# EAGLE design Foozle2650 (EAGLE 9.6.2)

## Sheet 1 of 2: Main
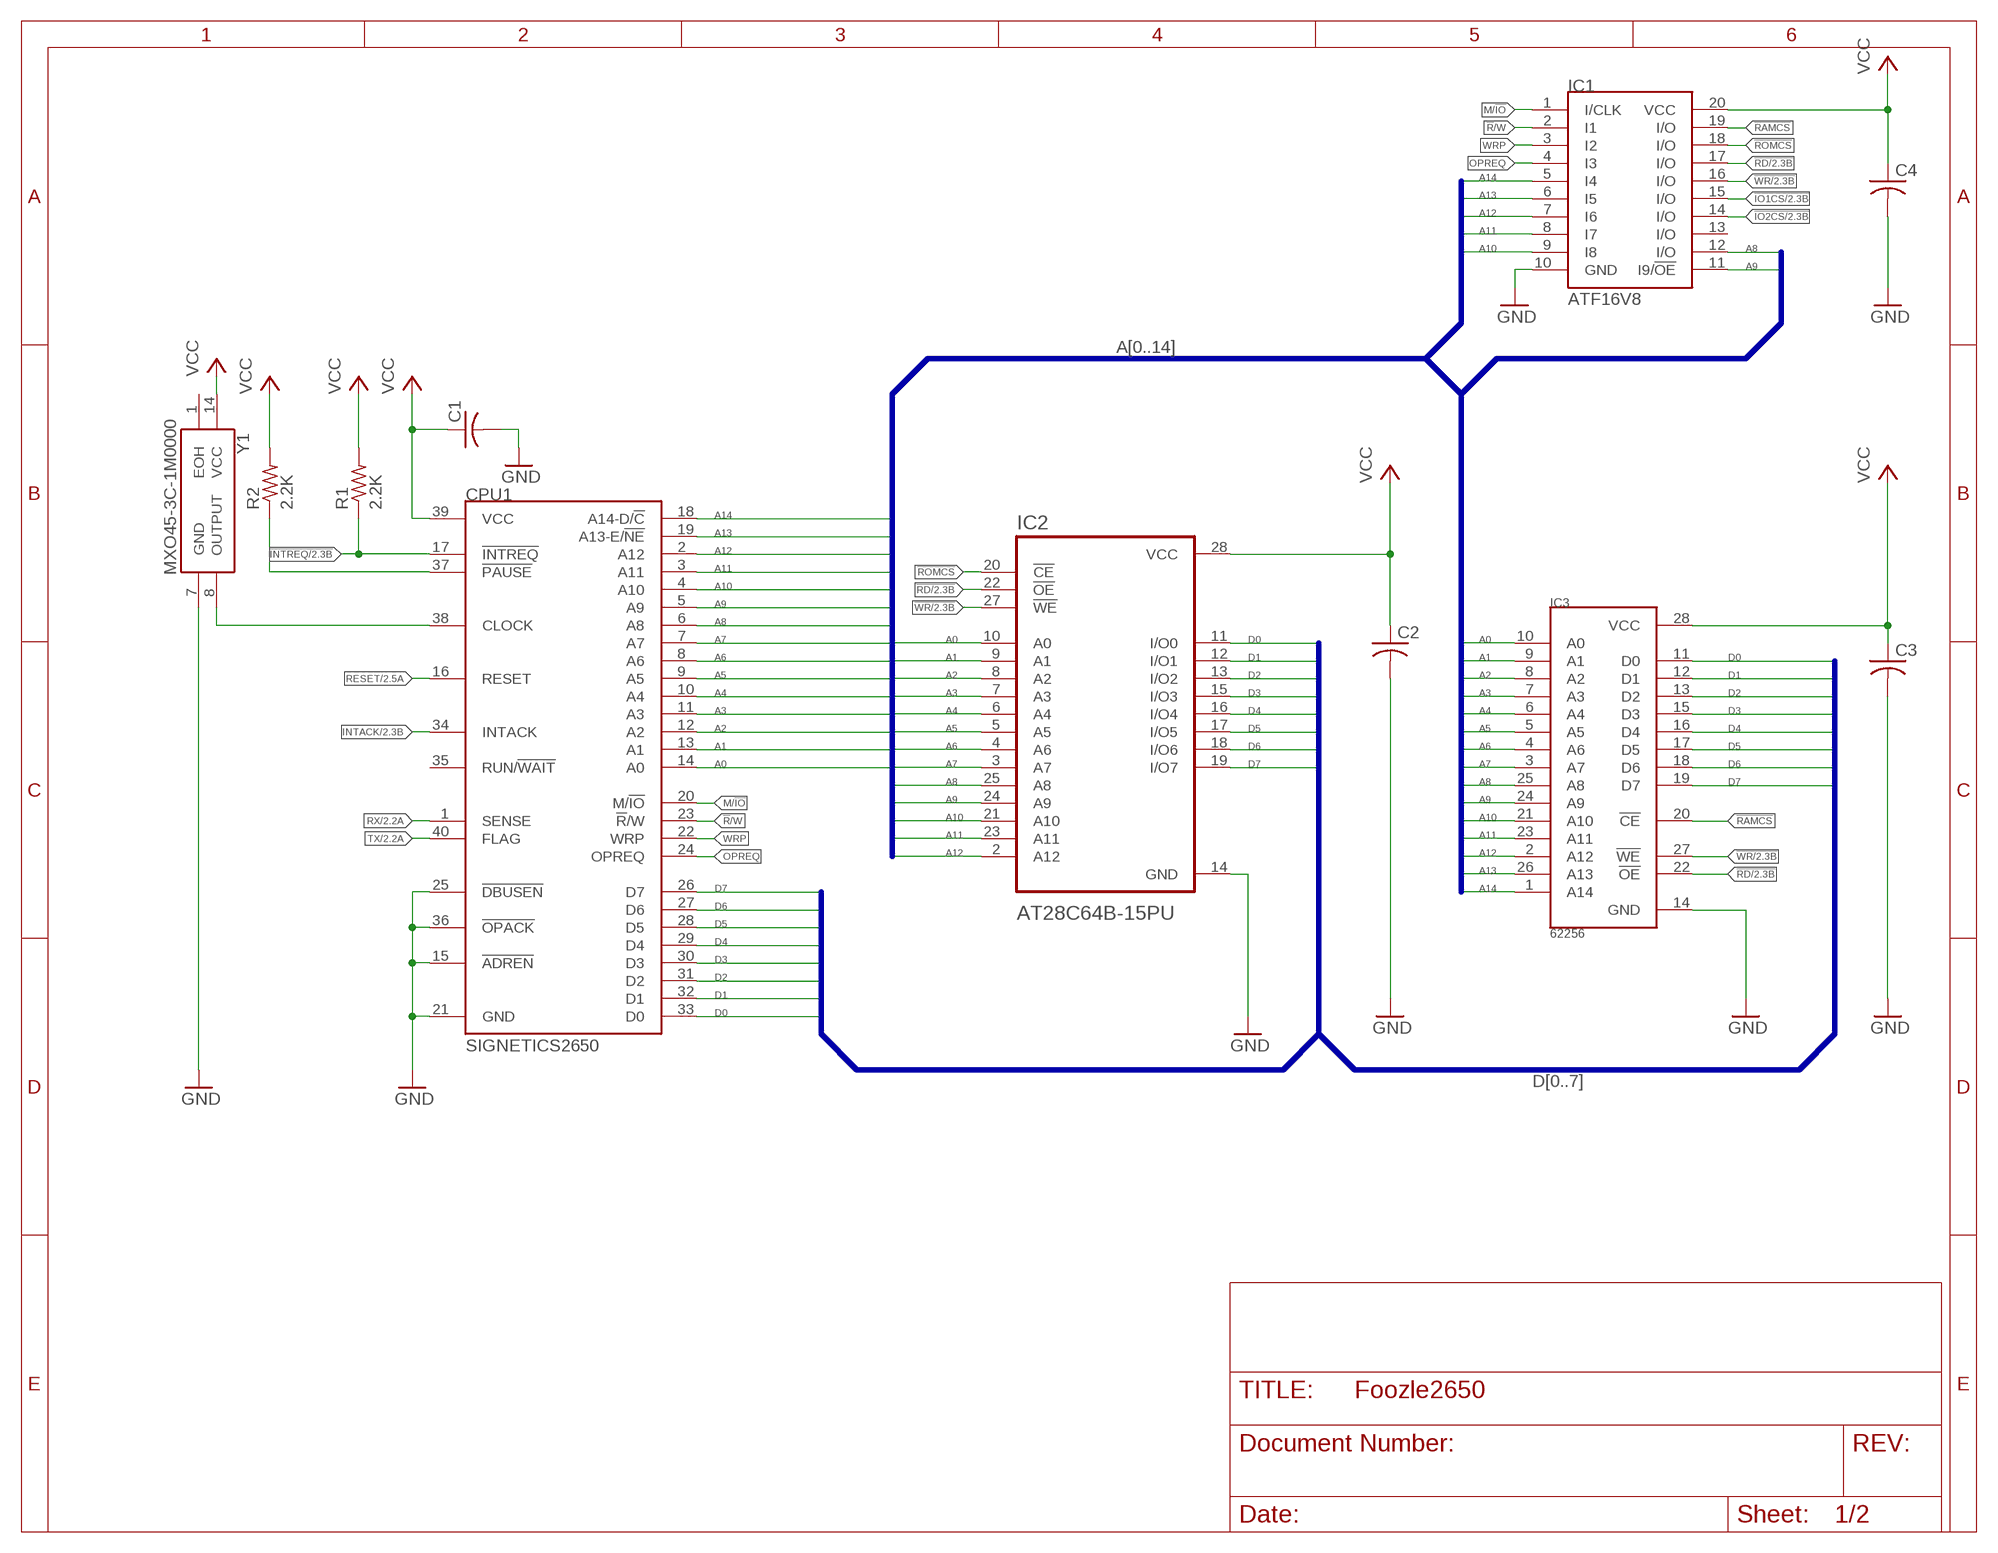
[diagram p0: schematic, sheet 1]

### Parts
C1  C-US025-024X044  [C025-024X044]
C2  C-US025-024X044  [C025-024X044]
C3  C-US025-024X044  [C025-024X044]
C4  C-US025-024X044  [C025-024X044]
CPU1  SIGNETICS2650  [DIL40]
IC1  ATF16V8  [DIL20]
IC2  AT28C64B-15PU  [DIP1555W45P254L3733H482Q28]
IC3  62256  [DIP-28/600MIL]
R1  2.2K  R-US_0204/7  [0204/7]
R2  2.2K  R-US_0204/7  [0204/7]
Y1  MXO45-3C-1M0000  [MXO453C1M0000]

### Nets
!INTREQ: CPU1.17(!INTREQ) R1.1 ; also sheet 2
!IO1CS: IC1.15(I/O) ; also sheet 2
!IO2CS: IC1.14(I/O) ; also sheet 2
!R!/W: CPU1.23(!R!/W) IC1.2(I1)
!RAMCS: IC1.19(I/O) IC3.20(!CE)
!RD: IC1.17(I/O) IC2.22(!OE) IC3.22(!OE) ; also sheet 2
!ROMCS: IC1.18(I/O) IC2.20(!CE)
!WR: IC1.16(I/O) IC2.27(!WE) IC3.27(!WE) ; also sheet 2
A0: CPU1.14(A0) IC2.10(A0) IC3.10(A0) ; also sheet 2
A1: CPU1.13(A1) IC2.9(A1) IC3.9(A1) ; also sheet 2
A2: CPU1.12(A2) IC2.8(A2) IC3.8(A2) ; also sheet 2
A3: CPU1.11(A3) IC2.7(A3) IC3.7(A3) ; also sheet 2
A4: CPU1.10(A4) IC2.6(A4) IC3.6(A4) ; also sheet 2
A5: CPU1.9(A5) IC2.5(A5) IC3.5(A5) ; also sheet 2
A6: CPU1.8(A6) IC2.4(A6) IC3.4(A6) ; also sheet 2
A7: CPU1.7(A7) IC2.3(A7) IC3.3(A7)
A8: CPU1.6(A8) IC1.12(I/O) IC2.25(A8) IC3.25(A8)
A9: CPU1.5(A9) IC1.11(I9/!OE) IC2.24(A9) IC3.24(A9)
A10: CPU1.4(A10) IC1.9(I8) IC2.21(A10) IC3.21(A10)
A11: CPU1.3(A11) IC1.8(I7) IC2.23(A11) IC3.23(A11)
A12: CPU1.2(A12) IC1.7(I6) IC2.2(A12) IC3.2(A12)
A13: CPU1.19(A13-E/!NE) IC1.6(I5) IC3.26(A13)
A14: CPU1.18(A14-D/!C) IC1.5(I4) IC3.1(A14)
CLOCK: CPU1.38(CLOCK) Y1.8(OUTPUT) ; also sheet 2
D0: CPU1.33(D0) IC2.11(I/O0) IC3.11(D0) ; also sheet 2
D1: CPU1.32(D1) IC2.12(I/O1) IC3.12(D1) ; also sheet 2
D2: CPU1.31(D2) IC2.13(I/O2) IC3.13(D2) ; also sheet 2
D3: CPU1.30(D3) IC2.15(I/O3) IC3.15(D3) ; also sheet 2
D4: CPU1.29(D4) IC2.16(I/O4) IC3.16(D4) ; also sheet 2
D5: CPU1.28(D5) IC2.17(I/O5) IC3.17(D5) ; also sheet 2
D6: CPU1.27(D6) IC2.18(I/O6) IC3.18(D6) ; also sheet 2
D7: CPU1.26(D7) IC2.19(I/O7) IC3.19(D7) ; also sheet 2
GND: C1.2 C2.2 C3.2 C4.2 CPU1.15(!ADREN) CPU1.21(GND) CPU1.25(!DBUSEN) CPU1.36(!OPACK) IC1.10(GND) IC2.14(GND) IC3.14(GND) Y1.7(GND) ; also sheet 2
INTACK: CPU1.34(INTACK) ; also sheet 2
M/!IO: CPU1.20(M/!IO) IC1.1(I/CLK)
N$3: CPU1.37(!PAUSE) R2.1
OPREQ: CPU1.24(OPREQ) IC1.4(I3)
RESET: CPU1.16(RESET) ; also sheet 2
RX: CPU1.1(SENSE) ; also sheet 2
TX: CPU1.40(FLAG) ; also sheet 2
VCC: C1.1 C2.1 C3.1 C4.1 CPU1.39(VCC) IC1.20(VCC) IC2.28(VCC) IC3.28(VCC) R1.2 R2.2 Y1.14(VCC) ; also sheet 2
WRP: CPU1.22(WRP) IC1.3(I2)
Unconnected: CPU1.35(RUN/!WAIT) IC1.13(I/O) Y1.1(EOH)

### Buses
A[0..14]
D[0..7]

## Sheet 2 of 2: IO
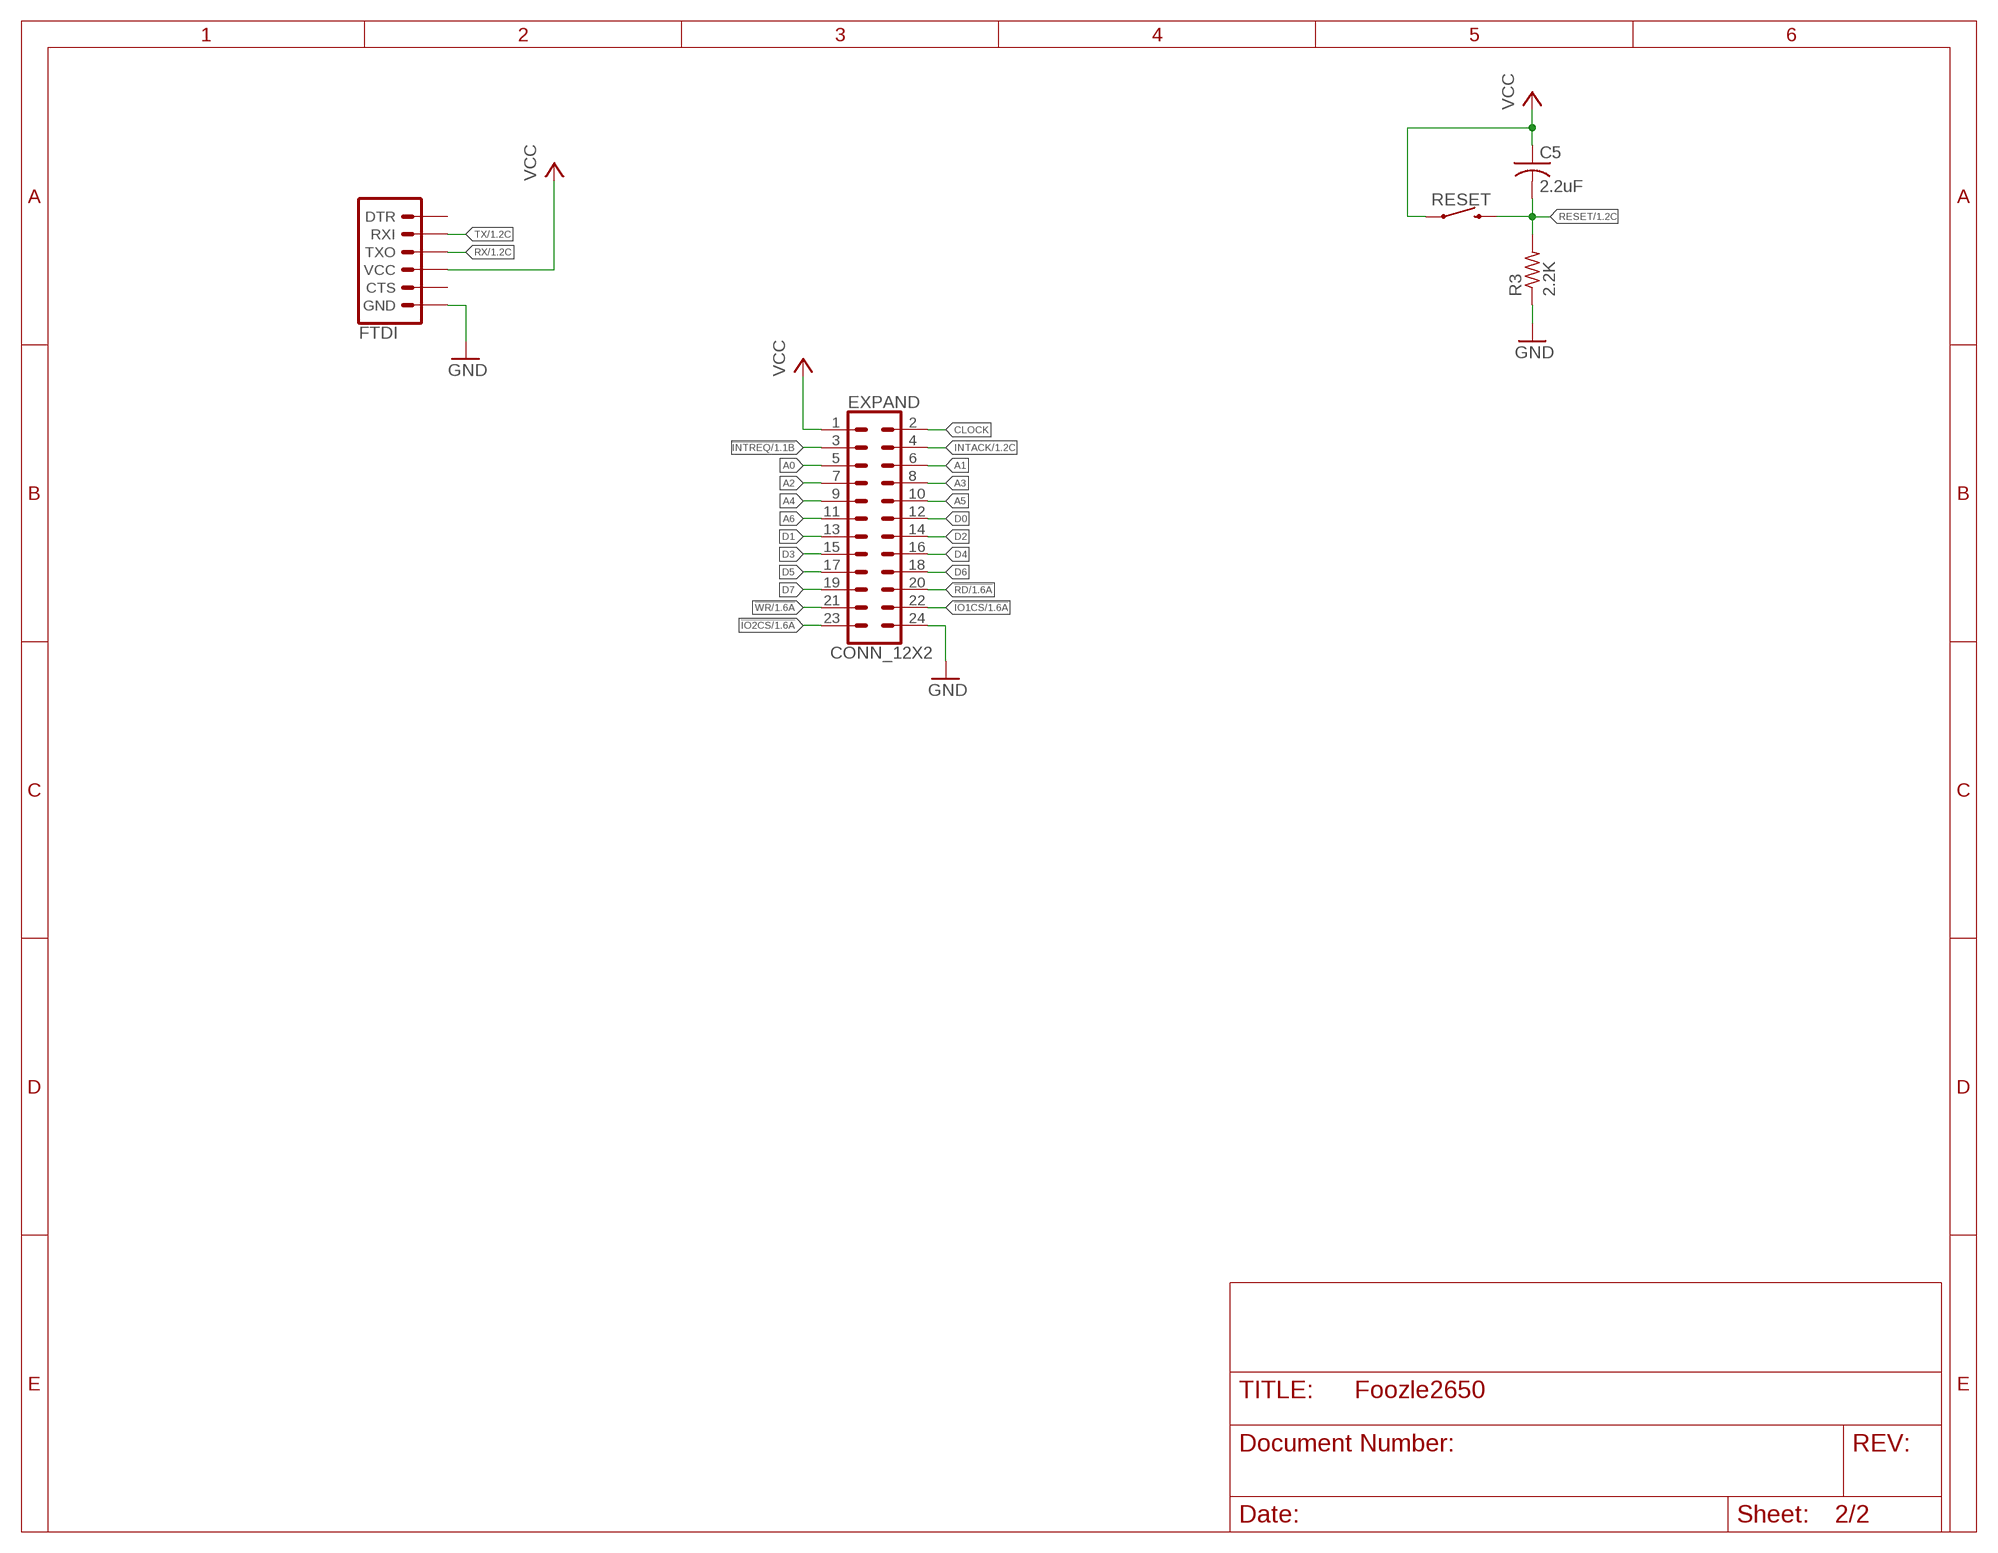
[diagram p1: schematic, sheet 2]

### Parts
C5  2.2uF  C-US025-024X044  [C025-024X044]
EXPAND  CONN_12X2  [2X12]
FTDI  6_PIN_SERIAL_TARGETLONGPADS  [1X06_LONGPADS]
R3  2.2K  R-US_0204/7  [0204/7]
RESET  MOMENTARY-SWITCH-SPST-PTH-6.0MM  [TACTILE_SWITCH_PTH_6.0MM]

### Nets
!INTREQ: EXPAND.3 ; also sheet 1
!IO1CS: EXPAND.22 ; also sheet 1
!IO2CS: EXPAND.23 ; also sheet 1
!RD: EXPAND.20 ; also sheet 1
!WR: EXPAND.21 ; also sheet 1
A0: EXPAND.5 ; also sheet 1
A1: EXPAND.6 ; also sheet 1
A2: EXPAND.7 ; also sheet 1
A3: EXPAND.8 ; also sheet 1
A4: EXPAND.9 ; also sheet 1
A5: EXPAND.10 ; also sheet 1
A6: EXPAND.11 ; also sheet 1
CLOCK: EXPAND.2 ; also sheet 1
D0: EXPAND.12 ; also sheet 1
D1: EXPAND.13 ; also sheet 1
D2: EXPAND.14 ; also sheet 1
D3: EXPAND.15 ; also sheet 1
D4: EXPAND.16 ; also sheet 1
D5: EXPAND.17 ; also sheet 1
D6: EXPAND.18 ; also sheet 1
D7: EXPAND.19 ; also sheet 1
GND: EXPAND.24 FTDI.6(GND) R3.1 ; also sheet 1
INTACK: EXPAND.4 ; also sheet 1
RESET: C5.2 R3.2 RESET.3 ; also sheet 1
RX: FTDI.3(TXO) ; also sheet 1
TX: FTDI.2(RXI) ; also sheet 1
VCC: C5.1 EXPAND.1 FTDI.4(VCC) RESET.1 ; also sheet 1
Unconnected: FTDI.1(DTR) FTDI.5(CTS)

## Library data of the parts
C1-C5 = adafruit:C-US: CAPACITOR, American symbol
CPU1 = StuffLabs:SIGNETICS2650
EXPAND = SparkFun-Connectors:CONN_12X2: Multi connection point. Often used as Generic Header-pin footprint for 0.1 inch spaced/style header connections On any of the 0.1 inch spaced packages, you can populate with these: Break Away Headers - Straight <https://www.sparkfun.com/products/116> (PRT-00116) Break Away Male Headers - Right Angle <https://www.sparkfun.com/products/553> (PRT-00553) Female Headers <https://www.sparkfun.com/products/115> (PRT-00115) Break Away Headers - Machine Pin <https://www.sparkfun.com/products/117> (PRT-00117) Break Away Female Headers - Swiss Machine Pin <https://www.sparkfun.com/products/743> (PRT-00743)
FTDI = SparkFun-Connectors:6_PIN_SERIAL_TARGET: 6-pin header connection for use with the "FTDI BASIC" pinout - TARGET SIDE. Also known as "Arduino Serial Program Header". It is used to mate with our FTDI Basic serial programmers using the Arduino IDE. Note, this device has "TARGET" in the name. It is intended to be used on a design that contains a target micro-controller that you wish to program. The "sister" device, named "CABLE" is inteneded to be used on a design that usually lives on the end of your USB cable and prvides the converter chip (FTDI232 or FTDI231x) to commnicate serial RX/TX. You can populate with some of these: Break Away Headers - Straight <https://www.sparkfun.com/products/116> (PRT-00116) For reference (or to suit your programming needs) check out these designs: SparkFun FTDI Basic Breakout - 5V <https://www.sparkfun.com/products/9716> (DEV-09716) SparkFun FTDI Basic Breakout - 3.3V <https://www.sparkfun.com/products/9873> (DEV-09873) SparkFun FTDI SmartBasic <https://www.sparkfun.com/products/12935> (DEV-12935) SparkFun Beefy 3 - FTDI Basic Breakout <https://www.sparkfun.com/products/13746> (DEV-13746)
IC1 = StuffLabs:ATF16V8: ATMEL ATF16v8 EEPLD
IC2 = StuffLabs:AT28C64B-15PU: EEPROM Memory IC 64Kb (8K x 8) Parallel 150ns 28-PDIP; AVAILABILITY: Unavailable; DESCRIPTION: IC EEPROM 64K PARALLEL 28DIP; DIGIKEY-PURCHASE-URL: https://snapeda.com/shop?store=DigiKey&id=4816400; MF: Microchip Technology; MOUSER-PURCHASE-URL: https://snapeda.com/shop?store=Mouser&id=4816400; MP: AT28C64B-15PU; PACKAGE: None; PRICE: None
IC3 = StuffLabs:62256: 62256 Static RAM
R1-R3 = adafruit:R-US_: RESISTOR, American symbol
RESET = SparkFun-Switches:MOMENTARY-SWITCH-SPST: Momentary Switch (Pushbutton) - SPST Normally-open (NO) SPST momentary switches (buttons, pushbuttons). Variants PTH-12MM - 12mm square, through-hole Momentary Pushbutton Switch - 12mm Square <https://www.sparkfun.com/products/9190> (COM-09190) PTH-6.0MM, PTH-6.0MM-KIT - 6.0mm square, through-hole Mini Pushbutton Switch <https://www.sparkfun.com/products/97> (COM-00097) KIT package intended for soldering kit's - only one side of pads' copper is exposed. PTH-RIGHT-ANGLE-KIT - Right-angle, through-hole Right Angle Tactile Button <https://www.sparkfun.com/products/10791> - Used on SparkFun BigTime Watch Kit <https://www.sparkfun.com/products/11734> SMD-12MM - 12mm square, surface-mount Tactile Button - SMD (12mm) <https://www.sparkfun.com/products/12993> (COM-12993) Used on SparkFun PicoBoard <https://www.sparkfun.com/products/11888> SMD-4.5MM - 4.5mm Square Trackball Switch Used on SparkFun Blackberry Trackballer Breakout <https://www.sparkfun.com/products/13169> SMD-4.6MMX2.8MM - 4.60mm x 2.80mm, surface mount Used on SparkFun SAMD21 Mini Breakout <https://www.sparkfun.com/products/13664> SMD-5.2MM, SMD-5.2-REDUNDANT - 5.2mm square, surface-mount Mini Pushbutton Switch - SMD <https://www.sparkfun.com/products/8720> (COM-08720) Used on Arduino Pro Mini <https://www.sparkfun.com/products/11114> REDUNDANT package connects both switch circuits together SMD-6.0X3.5MM - 6.0 x 3.5mm, surface mount Momentary Reset Switch SMD <https://www.sparkfun.com/products/8229> (COM-08229) SMD-6.2MM-TALL - 6.2mm square, surface mount Tactile Button - SMD (6mm) <https://www.sparkfun.com/products/12992> Used on SparkFun Digital Sandbox <https://www.sparkfun.com/products/12651> SMD-RIGHT-ANGLE - Right-angle, surface mount Used on SparkFun Block for Intel® Edison - Arduino <https://www.sparkfun.com/products/13036>; PROD_ID: SWCH-08441; SF_SKU: COM-00097
Y1 = StuffLabs:MXO45-3C-1M0000: Standard Clock Oscillators 1.00000 MHz Source: Datasheet <https://componentsearchengine.com/Datasheets/1/MXO45-3C-1M0000.pdf>; DESCRIPTION: Standard Clock Oscillators 1.00000 MHz; HEIGHT: 6.1mm; MANUFACTURER_NAME: CTS; MANUFACTURER_PART_NUMBER: MXO45-3C-1M0000; MOUSER_PART_NUMBER: 774-MXO45-3C-1.0; MOUSER_PRICE-STOCK: https://www.mouser.co.uk/ProductDetail/CTS-Electronic-Components/MXO45-3C-1M0000/?qs=hbgUSdfWRJUFs0kP0zCadA%3D%3D

## Board
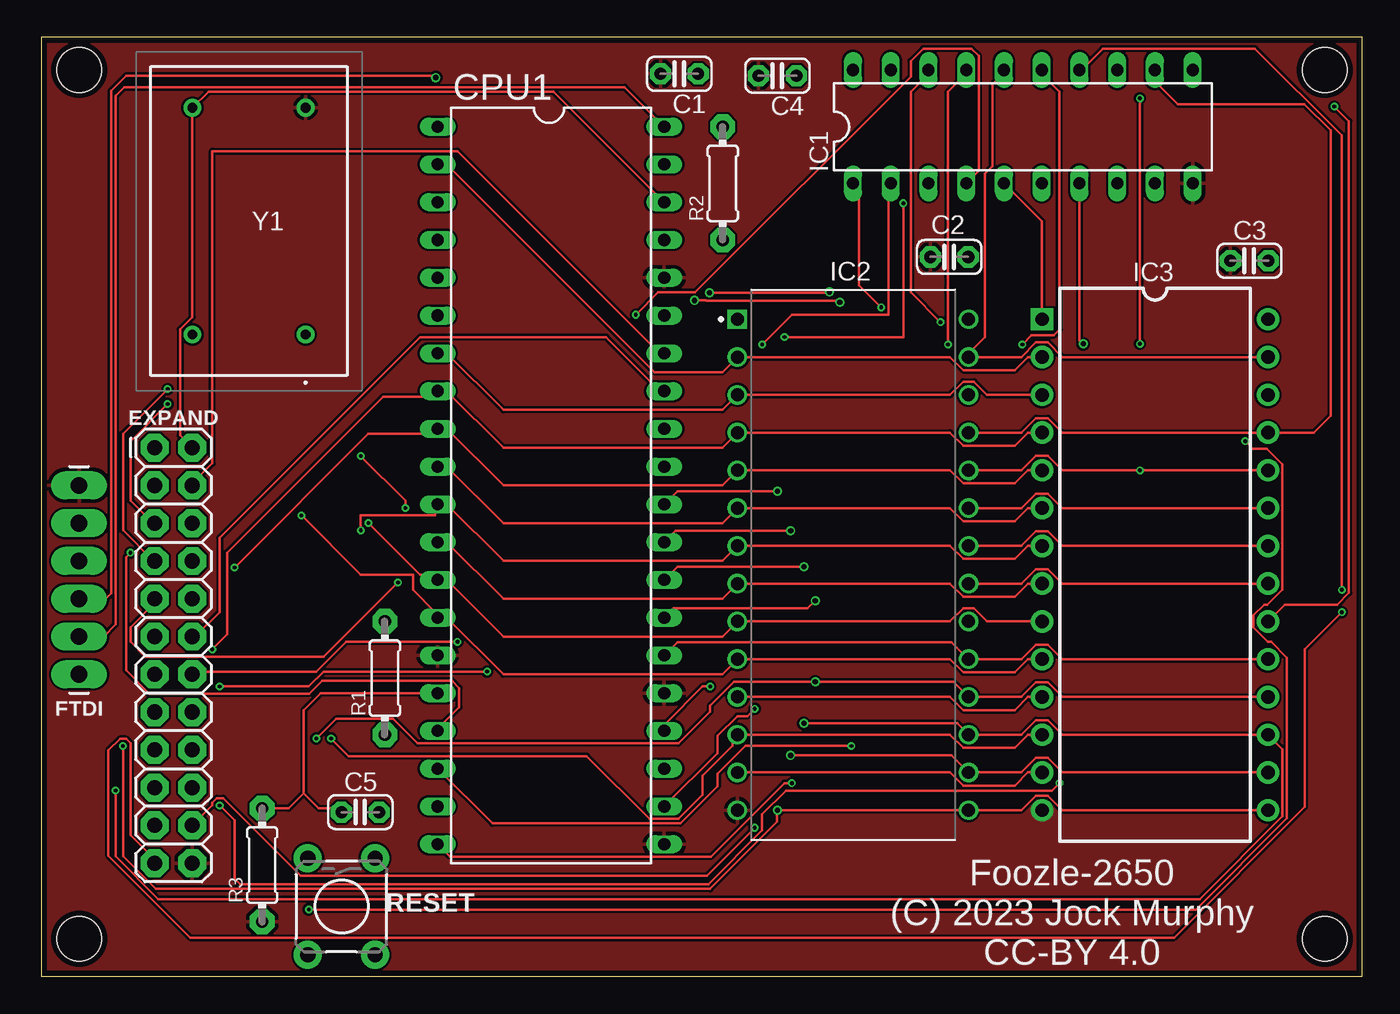
[diagram p2: board, top side]
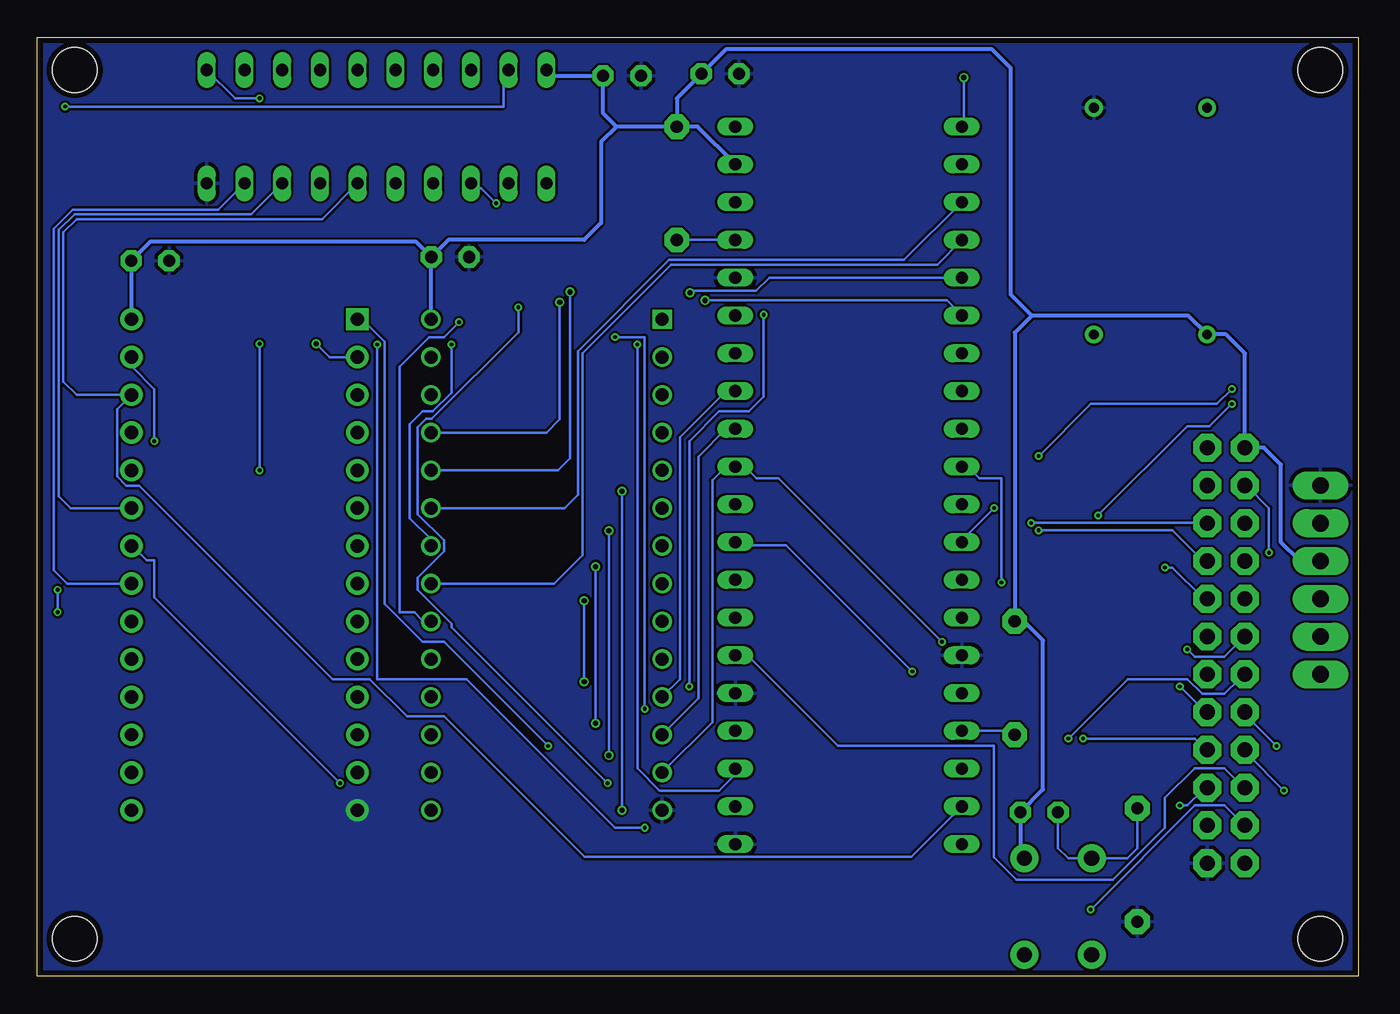
[diagram p3: board, bottom side, seen from below]

Size 88.88 x 63.17 mm. Coordinates in mm from the lower left corner, seen from the top.
Outline: 0,0 88.88,0 88.88,63.17 0,63.17 0,0
Copper layers (1*16): Top 0.035559375mm / dielectric 1.6mm / Bottom 0.035559375mm
Design rules "oshpark-2layer-jem": minimum track width 6mil, minimum drill 10mil, track to track 6mil, track to pad 6mil, pad to pad 6mil, via to via 6mil, smd to smd 6mil, copper to edge 15mil, drill to drill 6mil, minimum pad ring 5mil, minimum via ring 5mil, stop-mask expansion 2.5mil, vias tented up to drill 20mil, thermal gap 10mil
Holes 3 mm at 2.54,60.96 86.36,60.96 2.54,2.54 86.36,2.54

### Footprints (pad centres in the part's own frame; a part is rotated, then mirrored left to right if it is on the bottom)
C025-024X044 = drill 0.813 pad 1.422 octagon: 1 -1.27,0; 2 1.27,0
DIL40 = drill 0.813 long: 1 -24.13,-7.62; 2 -21.59,-7.62; 3 -19.05,-7.62; 4 -16.51,-7.62; 5 -13.97,-7.62; 6 -11.43,-7.62; 7 -8.89,-7.62; 8 -6.35,-7.62; 9 -3.81,-7.62; 10 -1.27,-7.62; 11 1.27,-7.62; 12 3.81,-7.62; 13 6.35,-7.62; 14 8.89,-7.62; 15 11.43,-7.62; 16 13.97,-7.62; 17 16.51,-7.62; 18 19.05,-7.62; 19 21.59,-7.62; 20 24.13,-7.62; 21 24.13,7.62; 22 21.59,7.62; 23 19.05,7.62; 24 16.51,7.62; 25 13.97,7.62; 26 11.43,7.62; 27 8.89,7.62; 28 6.35,7.62; 29 3.81,7.62; 30 1.27,7.62; 31 -1.27,7.62; 32 -3.81,7.62; 33 -6.35,7.62; 34 -8.89,7.62; 35 -11.43,7.62; 36 -13.97,7.62; 37 -16.51,7.62; 38 -19.05,7.62; 39 -21.59,7.62; 40 -24.13,7.62
2X12 = drill 1.016 pad 1.88 octagon: 1 0,0; 2 0,2.54; 3 2.54,0; 4 2.54,2.54; 5 5.08,0; 6 5.08,2.54; 7 7.62,0; 8 7.62,2.54; 9 10.16,0; 10 10.16,2.54; 11 12.7,0; 12 12.7,2.54; 13 15.24,0; 14 15.24,2.54; 15 17.78,0; 16 17.78,2.54; 17 20.32,0; 18 20.32,2.54; 19 22.86,0; 20 22.86,2.54; 21 25.4,0; 22 25.4,2.54; 23 27.94,0; 24 27.94,2.54
1X06_LONGPADS = drill 1.118 pad 1.88 long: 1 0,0; 2 2.54,0; 3 5.08,0; 4 7.62,0; 5 10.16,0; 6 12.7,0
DIL20 = drill 0.813 long: 1 -11.43,-3.81; 2 -8.89,-3.81; 3 -6.35,-3.81; 4 -3.81,-3.81; 5 -1.27,-3.81; 6 1.27,-3.81; 7 3.81,-3.81; 8 6.35,-3.81; 9 8.89,-3.81; 10 11.43,-3.81; 11 11.43,3.81; 12 8.89,3.81; 13 6.35,3.81; 14 3.81,3.81; 15 1.27,3.81; 16 -1.27,3.81; 17 -3.81,3.81; 18 -6.35,3.81; 19 -8.89,3.81; 20 -11.43,3.81
DIP1555W45P254L3733H482Q28 = drill 0.87 square: 1 -7.779,16.51 | drill 0.87: 2 -7.779,13.97; 3 -7.779,11.43; 4 -7.779,8.89; 5 -7.779,6.35; 6 -7.779,3.81; 7 -7.779,1.27; 8 -7.779,-1.27; 9 -7.779,-3.81; 10 -7.779,-6.35; 11 -7.779,-8.89; 12 -7.779,-11.43; 13 -7.779,-13.97; 14 -7.779,-16.51; 15 7.779,-16.51; 16 7.779,-13.97; 17 7.779,-11.43; 18 7.779,-8.89; 19 7.779,-6.35; 20 7.779,-3.81; 21 7.779,-1.27; 22 7.779,1.27; 23 7.779,3.81; 24 7.779,6.35; 25 7.779,8.89; 26 7.779,11.43; 27 7.779,13.97; 28 7.779,16.51
DIP-28/600MIL = drill 0.9 pad 1.5 square: 1 -7.6,16.51 | drill 0.9 pad 1.5: 2 -7.6,13.97; 3 -7.6,11.43; 4 -7.6,8.89; 5 -7.6,6.35; 6 -7.6,3.81; 7 -7.6,1.27; 8 -7.6,-1.27; 9 -7.6,-3.81; 10 -7.6,-6.35; 11 -7.6,-8.89; 12 -7.6,-11.43; 13 -7.6,-13.97; 14 -7.6,-16.51; 15 7.6,-16.51; 16 7.6,-13.97; 17 7.6,-11.43; 18 7.6,-8.89; 19 7.6,-6.35; 20 7.6,-3.81; 21 7.6,-1.27; 22 7.6,1.27; 23 7.6,3.81; 24 7.6,6.35; 25 7.6,8.89; 26 7.6,11.43; 27 7.6,13.97; 28 7.6,16.51
0204/7 = drill 0.813 pad 1.676 octagon: 1 -3.81,0; 2 3.81,0
TACTILE_SWITCH_PTH_6.0MM = drill 1.016 pad 1.88: 1 -3.251,2.261; 2 3.251,2.261; 3 -3.251,-2.261; 4 3.251,-2.261
MXO453C1M0000 = drill 0.65 pad 1.192: 1 0,0; 7 15.24,0; 8 15.24,7.62; 14 0,7.62

### Placement (x,y rotation side)
C1  42.93,60.71 180 top
C2  61.09,48.39 180 top
C3  81.28,48.13 180 top
C4  49.53,60.58 180 top
C5  21.46,11.05 180 top
CPU1  34.29,33.02 270 top
EXPAND  7.62,35.56 270 top
FTDI  2.54,20.32 90 top
IC1  66.04,57.15 0 top
IC2  54.61,27.69 0 top
IC3  74.93,27.69 0 top
R1  23.11,20.07 90 top
R2  45.85,53.34 90 top
R3  14.86,7.49 90 top
RESET  20.19,4.7 270 top
Y1  17.78,43.18 90 top

### Tracks (layer width: path | path; a pad name or v marks a point on that pad's centre or on a via)
!INTREQ  (via drill 0.25)
  Top 0.152: CPU1.17 26.67,16.67 28.12,18.12 28.12,19.4 27.63,19.89 18.89,19.89 18.02,19.02 7.27,19.02 5.7,20.59 5.7,28.2 v6,28.5
  Bottom 0.152: R1.1 23.37,16.51 CPU1.17 | v6,28.5 6,31.5 7.5,33 EXPAND.3
!IO1CS  (via drill 0.25)
  Top 0.152: v66,42.5 66.63,43.13 68.13,43.13 68.5,43.5 68.5,59.5 67.5,60.5 IC1.15 | EXPAND.22 11.5,11.5 11.5,11.68 11.8,11.98 12.25,11.98 17.45,6.78 44.78,6.78 v48,10
  Bottom 0.152: v66,42.5 66,20 60,20 50,10 v48,10
!IO2CS  (via drill 0.25)
  Top 0.152: v87.5,24.5 85,22 85,11.4 76.22,2.62 10.02,2.62 4.52,8.12 4.52,15.2 5.3,15.98 5.7,15.98 6,15.68 6,9.5 7.62,7.88 EXPAND.23 | IC1.14 69.96,60.96 71.41,62.41 81.66,62.41 87.5,56.57 v87.5,26
  Bottom 0.152: v87.5,24.5 v87.5,26
!R!/W  (via drill 0.25)
  Top 0.152: v48.5,42.5 50.5,44.5 57,44.5 57,53 IC1.2
  Bottom 0.152: v48.5,42.5 48.5,14 47,12.5 43,12.5 42,13.5 CPU1.23
!RAMCS  (via drill 0.25)
  Top 0.152: IC3.20 83.65,25 87.18,25 87.98,25.8 87.98,57.52 v87,58.5
  Bottom 0.152: v87,58.5 57.5,58.5 57.5,60.5 IC1.19
!RD  (via drill 0.25)
  Top 0.152: IC2.22 65.95,28.96 66.92,29.93 67.73,29.93 68.71,28.96 IC3.22 | v61,42.5 61,59.5 62,60.5 IC1.17 | v12,11.5 13,10.5 13,6.57 13.37,6.2 44.88,6.2 48.5,9.82 48.5,10.9 50.1,12.5 68,12.5 v68.5,13
  Bottom 0.152: v12,11.5 11.5,11.5 10.5,12.5 EXPAND.20 | v68.5,13 81,25.5 81,28 81.5,28 82,28.5 82.5,28.5 IC3.22 | IC2.22 62.39,29.39 63.8,30.8 63.8,37.13 62.93,38 62.26,38 61,39.26 v61,42.5
!ROMCS  (via drill 0.25)
  Top 0.152: v60.5,44 58.5,46 58.5,59.5 59.5,60.5 IC1.18
  Bottom 0.152: v60.5,44 61.5,43 62.5,43 64.5,41 64.5,24.5 63.5,24.5 63,24 62.5,24 IC2.20
!WR  (via drill 0.25)
  Top 0.152: IC3.27 68.71,41.66 67.73,42.63 66.92,42.63 65.95,41.66 IC2.27 62.5,42 63.5,43 63.5,54 64,54.5 64,60 64.5,60.5 IC1.16 | v81,36 81.5,35.5 82.45,35.5 83.51,34.44 83.51,26.01 82.5,25 82.27,25 81.55,24.28 81.55,23.47 82.52,22.5 82.75,22.5 83.81,21.44 83.81,10.64 77.67,4.5 v18,4.5
  Bottom 0.152: v18,4.5 11,11.5 9,11.5 8,10.5 EXPAND.21 | IC3.27 82.53,41.03 81,39.5 v81,36
A0  (via drill 0.25)
  Top 0.152: IC3.10 66.38,21.34 65.5,20.45 62.02,20.45 61.14,21.34 IC2.10 45.81,20.32 31.09,20.32 27.28,24.13 CPU1.14 26.5,24.5 25,26 25,27 21.5,27 v17.5,31 | v8.5,38.5 6,36 6,32 7.5,30.5 EXPAND.5
  Bottom 0.152: v8.5,38.5 10,37 11.5,37 v17.5,31
A1  (via drill 0.25)
  Top 0.152: IC3.9 63.63,23.88 62.75,24.76 62.02,24.76 61.14,23.88 IC2.9 45.81,22.86 31.09,22.86 27.28,26.67 CPU1.13 26.5,27 25.5,27 v22,30.5
  Bottom 0.152: v22,30.5 10.5,30.5 EXPAND.6
A2  (via drill 0.25)
  Top 0.152: IC3.8 66.38,26.42 65.5,25.54 62.02,25.54 61.14,26.42 IC2.8 45.81,25.4 31.09,25.4 27.28,29.21 CPU1.12 | v8.5,39.5 5.5,36.5 5.5,30 7.5,28 EXPAND.7 | v21.5,35 24.5,32 v24.5,31.5
  Bottom 0.152: v8.5,39.5 9.5,38.5 18,38.5 v21.5,35 | v24.5,31.5 26.5,29.5 CPU1.12
A3  (via drill 0.25)
  Top 0.152: IC3.7 66.38,28.96 65.5,28.07 62.02,28.07 61.14,28.96 IC2.7 45.81,27.94 31.09,27.94 27.28,31.75 CPU1.11 26.5,31.5 26.5,31 21.5,31 v21.5,30
  Bottom 0.152: v21.5,30 12.5,30 10.5,28 EXPAND.8
A4  (via drill 0.25)
  Top 0.152: IC3.6 66.38,31.5 65.5,30.61 62.02,30.61 61.14,31.5 IC2.6 45.81,30.48 31.09,30.48 27.28,34.29 CPU1.10 | v24,26.5 19,21.5 7,21.5 6,22.5 6,23.5 7.5,25 EXPAND.9
  Bottom 0.152: v24,26.5 24,33.5 25.5,33.5 26,34 26.5,34 CPU1.10
A5  (via drill 0.25)
  Top 0.152: IC3.5 66.38,34.04 65.5,33.16 62.02,33.16 61.14,34.04 IC2.5 45.81,33.02 31.09,33.02 27.28,36.83 CPU1.9 26.5,36.5 22,36.5 v13,27.5
  Bottom 0.152: v13,27.5 12.5,27.5 10.5,25.5 EXPAND.10
A6  (via drill 0.25)
  Top 0.152: IC3.4 66.38,36.58 65.5,35.7 62.02,35.7 61.14,36.58 IC2.4 45.81,35.56 31.09,35.56 27.28,39.37 CPU1.8 26.5,39 23,39 12.5,28.5 12.5,23 v11.5,22
  Bottom 0.152: v11.5,22 11,21.5 9,21.5 8,22.5 EXPAND.11
A7
  Top 0.152: IC3.3 63.63,39.12 62.75,40 62.02,40 61.14,39.12 IC2.3 45.81,38.1 31.09,38.1 27.28,41.91 CPU1.7
A8  (via drill 0.35)
  Top 0.152: IC2.25 65.95,36.58 66.92,37.55 67.73,37.55 68.71,36.58 IC3.25 85.6,36.58 86.74,37.72 86.74,56.9 84.96,58.67 76.45,58.67 74.93,60.2 IC1.12 | v43.94,45.47 44.72,45.47 44.74,45.44 53.62,45.44 v53.72,45.34
  Bottom 0.152: CPU1.6 27.69,45.47 v43.94,45.47 | v53.72,45.34 53.72,37.47 54.61,36.58 IC2.25
A9  (via drill 0.25, 0.35)
  Top 0.152: IC2.24 65.95,34.04 66.92,35.02 67.73,35.02 68.71,34.04 v73.91,34.04 IC3.24 | v44.96,45.97 52.83,45.97 52.96,46.1 v53.02,46.04 | v73.91,59.05 v73.91,42.55
  Bottom 0.152: CPU1.5 39.62,46.99 40.51,46.1 44.96,46.1 v44.96,45.97 | v53.02,46.04 53.02,34.86 53.85,34.04 IC2.24 | IC1.11 75.56,59.05 v73.91,59.05 | v73.91,42.55 v73.91,34.04
A10
  Top 0.152: IC2.21 65.95,26.42 66.92,27.39 67.73,27.39 68.71,26.42 IC3.21
  Bottom 0.152: CPU1.4 28.32,47.88 46.23,47.88 52.2,41.91 52.2,28.32 54.1,26.42 IC2.21 | IC1.9 76.71,51.56 86.49,51.56 87.76,50.29 87.76,27.3 86.87,26.42 IC3.21
A11
  Top 0.152: IC2.23 65.95,31.5 66.92,32.48 67.73,32.48 68.71,31.5 IC3.23
  Bottom 0.152: CPU1.3 30.56,48.18 46.35,48.18 52.5,42.04 52.5,32.38 53.39,31.5 IC2.23 | IC1.8 74.47,51.26 86.36,51.26 87.41,50.2 87.41,32.3 86.61,31.5 IC3.23
A12  (via drill 0.35)
  Top 0.152: IC3.2 66.38,41.66 65.5,40.77 62.02,40.77 61.14,41.66 IC2.2 45.81,40.64 41.25,40.64 27.28,54.61 CPU1.2 | IC1.7 69.85,42.8 v70.1,42.55
  Bottom 0.152: v70.1,42.55 69.22,41.66 IC3.2
A13
  Bottom 0.152: IC1.6 69.72,50.93 86.22,50.93 87.11,50.04 87.11,39.99 86.23,39.12 IC3.26 83.51,38.14 83.51,33.63 82.88,33 82,33 69,20 66.5,20 64,17.5 61.5,17.5 52.05,8.05 30.05,8.05 CPU1.19
A14  (via drill 0.25)
  Top 0.152: IC1.5 67.33,50.78 IC3.1 | v54.5,15.5 47.37,15.5 45.5,13.63 45.5,12.79 42.99,10.29 30.35,10.29 CPU1.18
  Bottom 0.152: v54.5,15.5 61.5,22.5 62.93,22.5 65.5,25.07 65.5,42.68 66.82,44 67.13,44 IC3.1
CLOCK
  Top 0.152: EXPAND.2 9.34,36.38 9.34,43.52 10.16,44.35 Y1.8 11.25,59.51 34.47,59.51 CPU1.38
D0
  Top 0.152: IC3.11 66.38,18.8 65.5,17.91 62.02,17.91 61.14,18.8 IC2.11 | EXPAND.12 10.5,23 12,24.5 12,29.5 25.5,43 38,43 41.5,39.5 CPU1.33
  Bottom 0.152: CPU1.33 42.52,39.37 45.63,36.26 45.63,20 IC2.11
D1  (via drill 0.25)
  Top 0.152: IC3.12 66.38,16.26 65.5,15.38 62.02,15.38 61.14,16.26 IC2.12 46.5,15.93 46.5,15.5 44.5,13.5 44.5,12.22 42.87,10.59 40.91,10.59 36.69,14.81 20.69,14.81 v19.5,16
  Bottom 0.152: CPU1.32 42.52,36.83 44.39,34.96 44.39,18.7 IC2.12 | v19.5,16 15.5,20 11.5,20 10.5,19 9,19 8,20 EXPAND.13
D2  (via drill 0.25)
  Top 0.152: IC3.13 66.38,13.72 65.5,12.84 62.02,12.84 61.14,13.72 IC2.13 | v28,22.5 20.5,22.5 18.5,20.5 10.5,20.5 EXPAND.14
  Bottom 0.152: IC2.13 43.45,17.09 43.45,33.36 42.52,34.29 CPU1.31 41.5,34 41,34 40.5,33.5 39,33.5 v28,22.5
D3  (via drill 0.25, 0.35)
  Top 0.152: IC3.15 68.71,11.18 67.73,12.15 66.92,12.15 65.95,11.18 IC2.15 v49.53,11.18 49.5,11.15 49.5,10.39 45,5.89 7.7,5.89 5.5,8.09 v5.5,15.5 | v49.53,32.64 42.8,32.64 CPU1.30
  Bottom 0.152: v49.53,11.18 v49.53,32.64 | v5.5,15.5 7.5,17.5 EXPAND.15
D4  (via drill 0.25, 0.35)
  Top 0.152: IC3.16 68.71,13.72 67.73,14.7 66.92,14.7 65.95,13.72 IC2.16 61.25,14.86 v50.42,14.86 | v50.42,29.97 42.67,29.97 CPU1.29 | v12,19.5 18,19.5 19,20.5 v30,20.5
  Bottom 0.152: v50.42,14.86 v50.42,29.97 | v12,19.5 10.5,18 EXPAND.16 | v30,20.5 38.5,29 41.5,29 CPU1.29
D5  (via drill 0.25, 0.35)
  Top 0.152: v51.31,27.56 42.8,27.56 CPU1.28 | v51.31,17.02 61.63,17.02 IC2.17 65.95,16.26 66.92,17.23 67.73,17.23 68.71,16.26 IC3.17 83.51,15.28 83.51,10.77 77.93,5.2 7.87,5.2 5,8.07 v5,12.5
  Bottom 0.152: v51.31,17.02 v51.31,27.56 | v5,12.5 7.5,15 EXPAND.17
D6  (via drill 0.25, 0.35)
  Top 0.152: IC3.18 68.71,18.8 67.73,19.77 66.92,19.77 65.95,18.8 IC2.18 61.37,19.81 v52.07,19.81 46.6,19.81 45,18.21 45,17.8 42.87,15.67 25.33,15.67 23.68,17.32 19.82,17.32 v18.5,16 | v52.07,25.27 51.56,24.77 42.55,24.77 CPU1.27
  Bottom 0.152: v52.07,19.81 v52.07,25.27 | v18.5,16 11,16 10.5,15.5 EXPAND.18
D7
  Top 0.152: IC3.19 68.71,21.34 67.73,22.32 66.92,22.32 65.95,21.34 IC2.19 61.25,22.48 47,22.48 46.99,22.48 42.8,22.48 CPU1.26
  Bottom 0.152: EXPAND.19 8,13 9,14 11,14 13,12 13,10 16.5,6.5 23,6.5 24.5,8 24.5,15.5 35,15.5 41,21.5 41.5,21.5 CPU1.26
GND
  pour Bottom: 0,63.5 88.9,63.5 88.9,0 0,0
  pour Top: 0,0 88.9,0 88.9,63.5 0,63.5
INTACK
  Top 0.152: CPU1.34 41.5,42 28,55.5 11.5,55.5 11.5,34.5 10.5,33.5 EXPAND.4
M/!IO  (via drill 0.25)
  Top 0.152: v50.5,13 50,13 45.05,8.05 27.51,8.05 CPU1.20 | v56.5,45 55,46.5 55,53 IC1.1
  Bottom 0.152: v50.5,13 61,23.5 61,23.73 63.27,26 63.27,26.83 61.51,28.59 61.51,29.32 63.27,31.08 63.27,36.94 62.71,37.5 62.33,37.5 56.5,43.33 v56.5,45
N$3
  Bottom 0.152: CPU1.37 R2.1
OPREQ  (via drill 0.25)
  Top 0.152: v45,19.5 44.5,19.5 42,17 CPU1.24 | v40,44.5 41.5,46 43.98,46 58.5,60.52 58.5,61.56 59.34,62.41 62.58,62.41 63.07,61.92 63.07,54.18 IC1.4
  Bottom 0.152: v45,19.5 45,36 43,38 41,38 40,39 v40,44.5
RESET
  Top 0.152: CPU1.16 18.8,19.05 17.65,17.91 17.65,12.32 | 17.65,12.32 16.64,11.3 R3.2 | 17.65,12.32 18.67,11.3 19.94,11.3 C5.2
  Bottom 0.152: R3.2 14.86,8.64 15.54,7.95 RESET.3 19.51,7.95 20.19,8.64 C5.2
RX  (via drill 0.35)
  Top 0.152: FTDI.3 4.32,25.4 4.7,25.78 4.7,59.56 5.71,60.58 26.67,60.58 v26.54,60.45
  Bottom 0.152: v26.54,60.45 26.54,57.28 CPU1.1
TX
  Top 0.152: FTDI.2 4.19,22.86 5,23.67 5,59.23 5.59,59.82 39.24,59.82 CPU1.40
VCC
  Bottom 0.254: IC3.28 82.53,48.11 C3.1 81.28,49.4 63.37,49.4 C2.1 | IC2.28 62.39,48.35 C2.1 | IC1.20 54.23,60.58 C4.1 50.8,58.04 49.91,57.15 | R2.2 49.91,57.15 | R2.2 45.85,59.05 C1.1 42.55,62.36 24.64,62.36 23.37,61.09 23.37,45.85 21.97,44.45 | CPU1.39 44.45,57.15 R2.2 | C2.1 61.21,49.53 52.07,49.53 50.93,50.67 50.93,56.13 49.91,57.15 | FTDI.4 3.94,27.94 5.21,29.21 5.21,34.42 6.35,35.56 EXPAND.1 7.62,41.91 8.89,43.18 Y1.14 11.43,44.45 21.97,44.45 | 21.97,44.45 23.11,43.31 R1.2 22.48,23.88 21.21,22.61 21.21,12.57 C5.1 22.73,8.23 RESET.1
WRP  (via drill 0.25)
  Top 0.152: v50,43 58,43 v58,52 | v48,18 47.5,17.5 46.83,17.5 45.5,16.17 45.5,15.02 CPU1.22
  Bottom 0.152: v48,18 48,43 v50,43 | v58,52 59,53 59.5,53 IC1.3

### Text on the board
tNames: IC3 | Foozle-2650 / (C) 2023 Jock Murphy / CC-BY 4.0